# Altium schematic sheet Overview.SchDoc
size A4; SheetNumber: 1; SheetTotal: 5
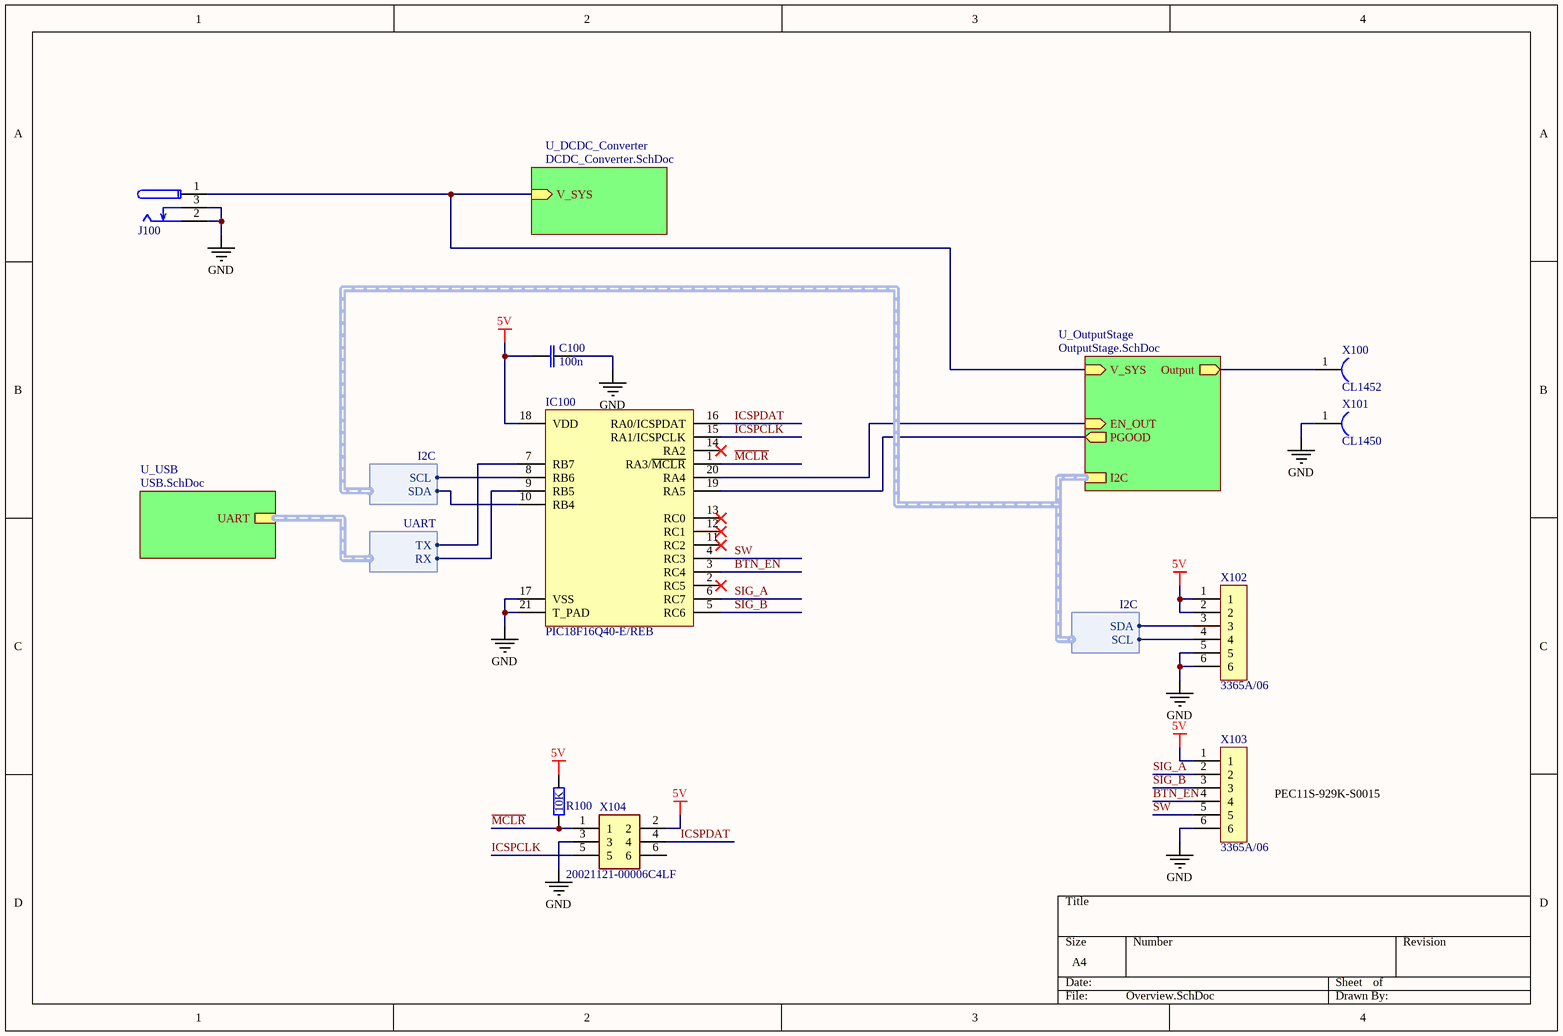
[diagram p0: Overview.SchDoc]

## Parts
C100  100n  [CAP0402]
IC100  PIC18F16Q40-E/REB  [QFN20_3X3(PIC18F16Q40)]
J100  54-00164  [54-00164]  (value not drawn)
R100  10K  [RES0402]  (value not drawn)
X100  CL1452  [THT_Solder_Point]
X101  CL1450  [THT_Solder_Point]
X102  3365A/06  [3M_CBL_RIBN_6X]
X103  3365A/06  [3M_CBL_RIBN_6X]
X104  20021121-00006C4LF  [20021121-00X06CXLF]

## Sub-sheets
U_DCDC_Converter = DCDC_Converter.SchDoc: V_SYS (in)
U_OutputStage = OutputStage.SchDoc: V_SYS (in), EN_OUT (in), PGOOD (out), I2C (harness I2C), Output (out)
U_USB = USB.SchDoc: UART (harness UART)

## Harnesses
I2C: SDA, SCL
UART: RX, TX

## Nets
5V: C100.2 IC100.18(VDD) R100.2 X102.1 X102.2 X103.1 X104.2
GND: C100.1 IC100.17(VSS) IC100.21(T_PAD) J100.2 J100.3 X101.1 X102.5 X102.6 X103.6 X104.3
BTN_EN: IC100.3(RC4) X103.4
ICSPCLK: IC100.15(RA1/ICSPCLK) X104.5
ICSPDAT: IC100.16(RA0/ICSPDAT) X104.4
~{MCLR}: IC100.1(RA3/~{MCLR}) R100.1 X104.1
SIG_A: IC100.6(RC7) X103.2
SIG_B: IC100.5(RC6) X103.3
SW: IC100.4(RC3) X103.5
NetIC100_7: IC100.7(RB7) ; sheet U_USB/UART.TX
NetIC100_8: IC100.8(RB6) X102.4 ; sheet U_OutputStage/I2C.SCL
NetIC100_9: IC100.9(RB5) ; sheet U_USB/UART.RX
NetIC100_10: IC100.10(RB4) X102.3 ; sheet U_OutputStage/I2C.SDA
NetIC100_19: IC100.19(RA5) ; sheet U_OutputStage/PGOOD
NetIC100_20: IC100.20(RA4) ; sheet U_OutputStage/EN_OUT
NetJ100_1: J100.1 ; sheet U_OutputStage/V_SYS, sheet U_DCDC_Converter/V_SYS
NetX100_1: X100.1 ; sheet U_OutputStage/Output

Not connected (* = marked no-connect by the designer): IC100 2(RC5)* 11(RC2)* 12(RC1)* 13(RC0)* 14(RA2)*; X104 6

## Notes on the sheet
- PEC11S-929K-S0015

## Library data of the parts
C100 = CL05A104KA5NNNC: MaxVoltage: 25V; Dialectric: X5R; Tolerance: 10%; Value: 100n; MPN: CL05A104KA5NNNC
R100 = RC0402JR-0710KL: Power: 0.063W; Tolerance: 5%; Value: 10K; MPN: RC0402JR-0710KL
X104 = 20021121-00006C4LF: Manufacturer: Amphenol ICC (FCI); JLCPCB Part #: C178291; Manufacturer Partnummber: 20021121-00006C4LF; MPN: 20021121-00006C4LF
J100 = 54-00164: MPN: 54-00164
X100 = CL1452: MPN: CL1452
X101 = CL1450: MPN: CL1450
X102 X103 = 3365A/06: MPN: 3365A/06